# EAGLE design apu-csk-motherboard (EAGLE 9.6.2)

## Sheet 1 of 2
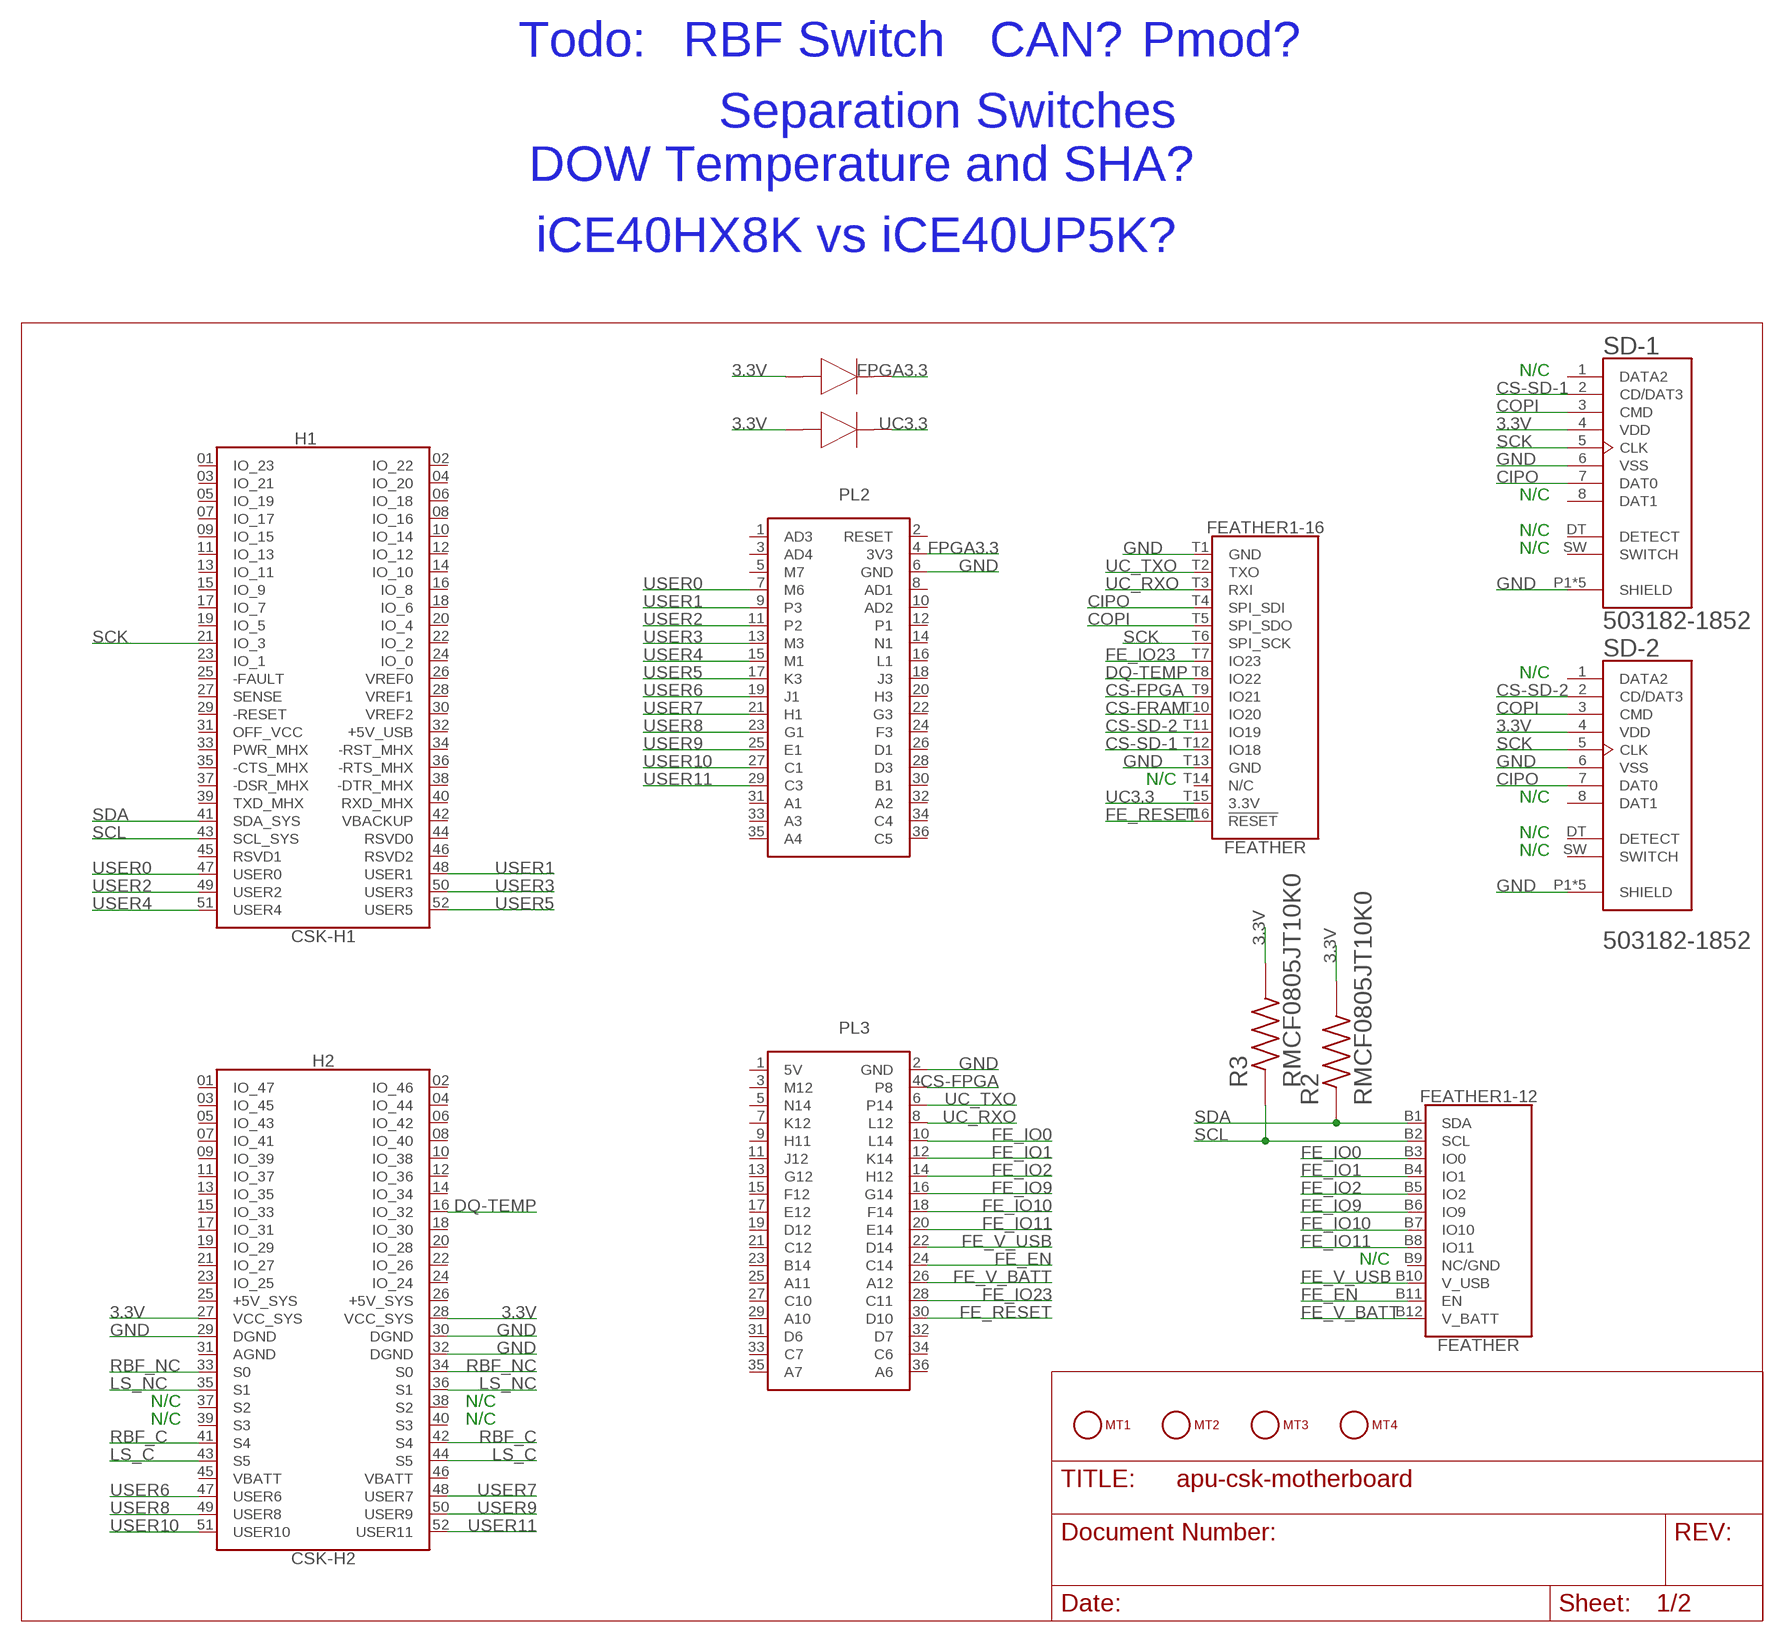
[diagram p0: schematic, sheet 1]

### Parts
B1  DIO_PMEG4030ER,115  [DIO_PMEG4030ER,115]
B2  DIO_PMEG4030ER,115  [DIO_PMEG4030ER,115]
FEATHER1  FEATHER  [FEATHER]
H1  CSK-H1  [SAMTEC_ESQ-126-37-G-D--NUMBERED-FOR-CUBESAT-BUS]
H2  CSK-H2  [SAMTEC_ESQ-126-37-G-D--NUMBERED-FOR-CUBESAT-BUS]
MT1  MOUNTING_HOLE-125_250_ROUND  [MT_125_250]
MT2  MOUNTING_HOLE-125_250_ROUND  [MT_125_250]
MT3  MOUNTING_HOLE-125_250_ROUND  [MT_125_250]
MT4  MOUNTING_HOLE-125_250_ROUND  [MT_125_250]
PL2  ICEWERX-PL2  [TE_4-1734506-1]
PL3  ICEWERX-PL3  [TE_4-1734506-1]
R2  RMCF0805JT10K0  [RESC2012X65N]
R3  RMCF0805JT10K0  [RESC2012X65N]
SD-1  503182-1852  [MOLEX_503182-1852]
SD-2  503182-1852  [MOLEX_503182-1852]

### Nets
3.3V: B1.2(ANODE) B2.2(ANODE) H2.27(VCC_SYS) H2.28(VCC_SYS) R2.2 R3.2 SD-1.4(VDD) SD-2.4(VDD) ; also sheet 2
CIPO: FEATHER1.T4(-16:SPI_SDI) SD-1.7(DAT0) SD-2.7(DAT0) ; also sheet 2
COPI: FEATHER1.T5(-16:SPI_SDO) SD-1.3(CMD) SD-2.3(CMD) ; also sheet 2
CS-FPGA: FEATHER1.T9(-16:IO21) PL3.4(P8)
CS-FRAM: FEATHER1.T10(-16:IO20) ; also sheet 2
CS-SD-1: FEATHER1.T12(-16:IO18) SD-1.2(CD/DAT3)
CS-SD-2: FEATHER1.T11(-16:IO19) SD-2.2(CD/DAT3)
DQ-TEMP: FEATHER1.T8(-16:IO22) H2.16(IO_32) ; also sheet 2
FE_EN: FEATHER1.B11(-12:EN) PL3.24(C14)
FE_IO0: FEATHER1.B3(-12:IO0) PL3.10(L14)
FE_IO1: FEATHER1.B4(-12:IO1) PL3.12(K14)
FE_IO2: FEATHER1.B5(-12:IO2) PL3.14(H12)
FE_IO9: FEATHER1.B6(-12:IO9) PL3.16(G14)
FE_IO10: FEATHER1.B7(-12:IO10) PL3.18(F14)
FE_IO11: FEATHER1.B8(-12:IO11) PL3.20(E14)
FE_IO23: FEATHER1.T7(-16:IO23) PL3.28(C11)
FE_RESET: FEATHER1.T16(-16:!RESET) PL3.30(D10)
FE_V_BATT: FEATHER1.B12(-12:V_BATT) PL3.26(A12)
FE_V_USB: FEATHER1.B10(-12:V_USB) PL3.22(D14)
FPGA3.3: B1.1(CATHODE) PL2.4(3V3)
GND: FEATHER1.T1(-16:GND) FEATHER1.T13(-16:GND) H2.29(DGND) H2.30(DGND) H2.32(DGND) PL2.6(GND) PL3.2(GND) SD-1.6(VSS) SD-1.P1(SHIELD) SD-1.P2(SHIELD) SD-1.P3(SHIELD) SD-1.P4(SHIELD) SD-1.P5(SHIELD) SD-2.6(VSS) SD-2.P1(SHIELD) SD-2.P2(SHIELD) SD-2.P3(SHIELD) SD-2.P4(SHIELD) SD-2.P5(SHIELD) ; also sheet 2
LS_C: H2.43(S5) H2.44(S5) ; also sheet 2
LS_NC: H2.35(S1) H2.36(S1) ; also sheet 2
RBF_C: H2.41(S4) H2.42(S4) ; also sheet 2
RBF_NC: H2.33(S0) H2.34(S0) ; also sheet 2
SCK: FEATHER1.T6(-16:SPI_SCK) H1.21(IO_3) SD-1.5(CLK) SD-2.5(CLK) ; also sheet 2
SCL: FEATHER1.B2(-12:SCL) H1.43(SCL_SYS) R3.1 ; also sheet 2
SDA: FEATHER1.B1(-12:SDA) H1.41(SDA_SYS) R2.1 ; also sheet 2
UC3.3: B2.1(CATHODE) FEATHER1.T15(-16:3.3V)
UC_RXO: FEATHER1.T3(-16:RXI) PL3.8(L12)
UC_TXO: FEATHER1.T2(-16:TXO) PL3.6(P14)
USER0: H1.47(USER0) PL2.7(M6)
USER1: H1.48(USER1) PL2.9(P3)
USER2: H1.49(USER2) PL2.11(P2)
USER3: H1.50(USER3) PL2.13(M3)
USER4: H1.51(USER4) PL2.15(M1)
USER5: H1.52(USER5) PL2.17(K3)
USER6: H2.47(USER6) PL2.19(J1)
USER7: H2.48(USER7) PL2.21(H1)
USER8: H2.49(USER8) PL2.23(G1)
USER9: H2.50(USER9) PL2.25(E1)
USER10: H2.51(USER10) PL2.27(C1)
USER11: H2.52(USER11) PL2.29(C3)
Unconnected: FEATHER1.B9(-12:NC/GND) FEATHER1.T14(-16:N/C) H1.01(IO_23) H1.02(IO_22) H1.03(IO_21) H1.04(IO_20) H1.05(IO_19) H1.06(IO_18) H1.07(IO_17) H1.08(IO_16) H1.09(IO_15) H1.10(IO_14) H1.11(IO_13) H1.12(IO_12) H1.13(IO_11) H1.14(IO_10) H1.15(IO_9) H1.16(IO_8) H1.17(IO_7) H1.18(IO_6) H1.19(IO_5) H1.20(IO_4) H1.22(IO_2) H1.23(IO_1) H1.24(IO_0) H1.25(-FAULT) H1.26(VREF0) H1.27(SENSE) H1.28(VREF1) H1.29(-RESET) H1.30(VREF2) H1.31(OFF_VCC) H1.32(+5V_USB) H1.33(PWR_MHX) H1.34(-RST_MHX) H1.35(-CTS_MHX) H1.36(-RTS_MHX) H1.37(-DSR_MHX) H1.38(-DTR_MHX) H1.39(TXD_MHX) H1.40(RXD_MHX) H1.42(VBACKUP) H1.44(RSVD0) H1.45(RSVD1) H1.46(RSVD2) H2.01(IO_47) H2.02(IO_46) H2.03(IO_45) H2.04(IO_44) H2.05(IO_43) H2.06(IO_42) H2.07(IO_41) H2.08(IO_40) H2.09(IO_39) H2.10(IO_38) H2.11(IO_37) H2.12(IO_36) H2.13(IO_35) H2.14(IO_34) H2.15(IO_33) H2.17(IO_31) H2.18(IO_30) H2.19(IO_29) H2.20(IO_28) H2.21(IO_27) H2.22(IO_26) H2.23(IO_25) H2.24(IO_24) H2.25(+5V_SYS) H2.26(+5V_SYS) H2.31(AGND) H2.37(S2) H2.38(S2) H2.39(S3) H2.40(S3) H2.45(VBATT) H2.46(VBATT) MT1.1 MT2.1 MT3.1 MT4.1 PL2.1(AD3) PL2.2(RESET) PL2.3(AD4) PL2.5(M7) PL2.8(AD1) PL2.10(AD2) PL2.12(P1) PL2.14(N1) PL2.16(L1) PL2.18(J3) PL2.20(H3) PL2.22(G3) PL2.24(F3) PL2.26(D1) PL2.28(D3) PL2.30(B1) PL2.31(A1) PL2.32(A2) PL2.33(A3) PL2.34(C4) PL2.35(A4) PL2.36(C5) PL3.1(5V) PL3.3(M12) PL3.5(N14) PL3.7(K12) PL3.9(H11) PL3.11(J12) PL3.13(G12) PL3.15(F12) PL3.17(E12) PL3.19(D12) PL3.21(C12) PL3.23(B14) PL3.25(A11) PL3.27(C10) PL3.29(A10) PL3.31(D6) PL3.32(D7) PL3.33(C7) PL3.34(C6) PL3.35(A7) PL3.36(A6) SD-1.1(DATA2) SD-1.8(DAT1) SD-1.DT(DETECT) SD-1.SW(SWITCH) SD-2.1(DATA2) SD-2.8(DAT1) SD-2.DT(DETECT) SD-2.SW(SWITCH)

### Notes on the sheet
- Todo: | RBF Switch | CAN? | Pmod?
- Separation Switches
- DOW Temperature and SHA?
- iCE40HX8K vs iCE40UP5K?
- N/C
- N/C
- N/C
- N/C
- N/C
- N/C
- N/C
- N/C
- N/C
- N/C
- N/C | N/C
- N/C | N/C

## Sheet 2 of 2
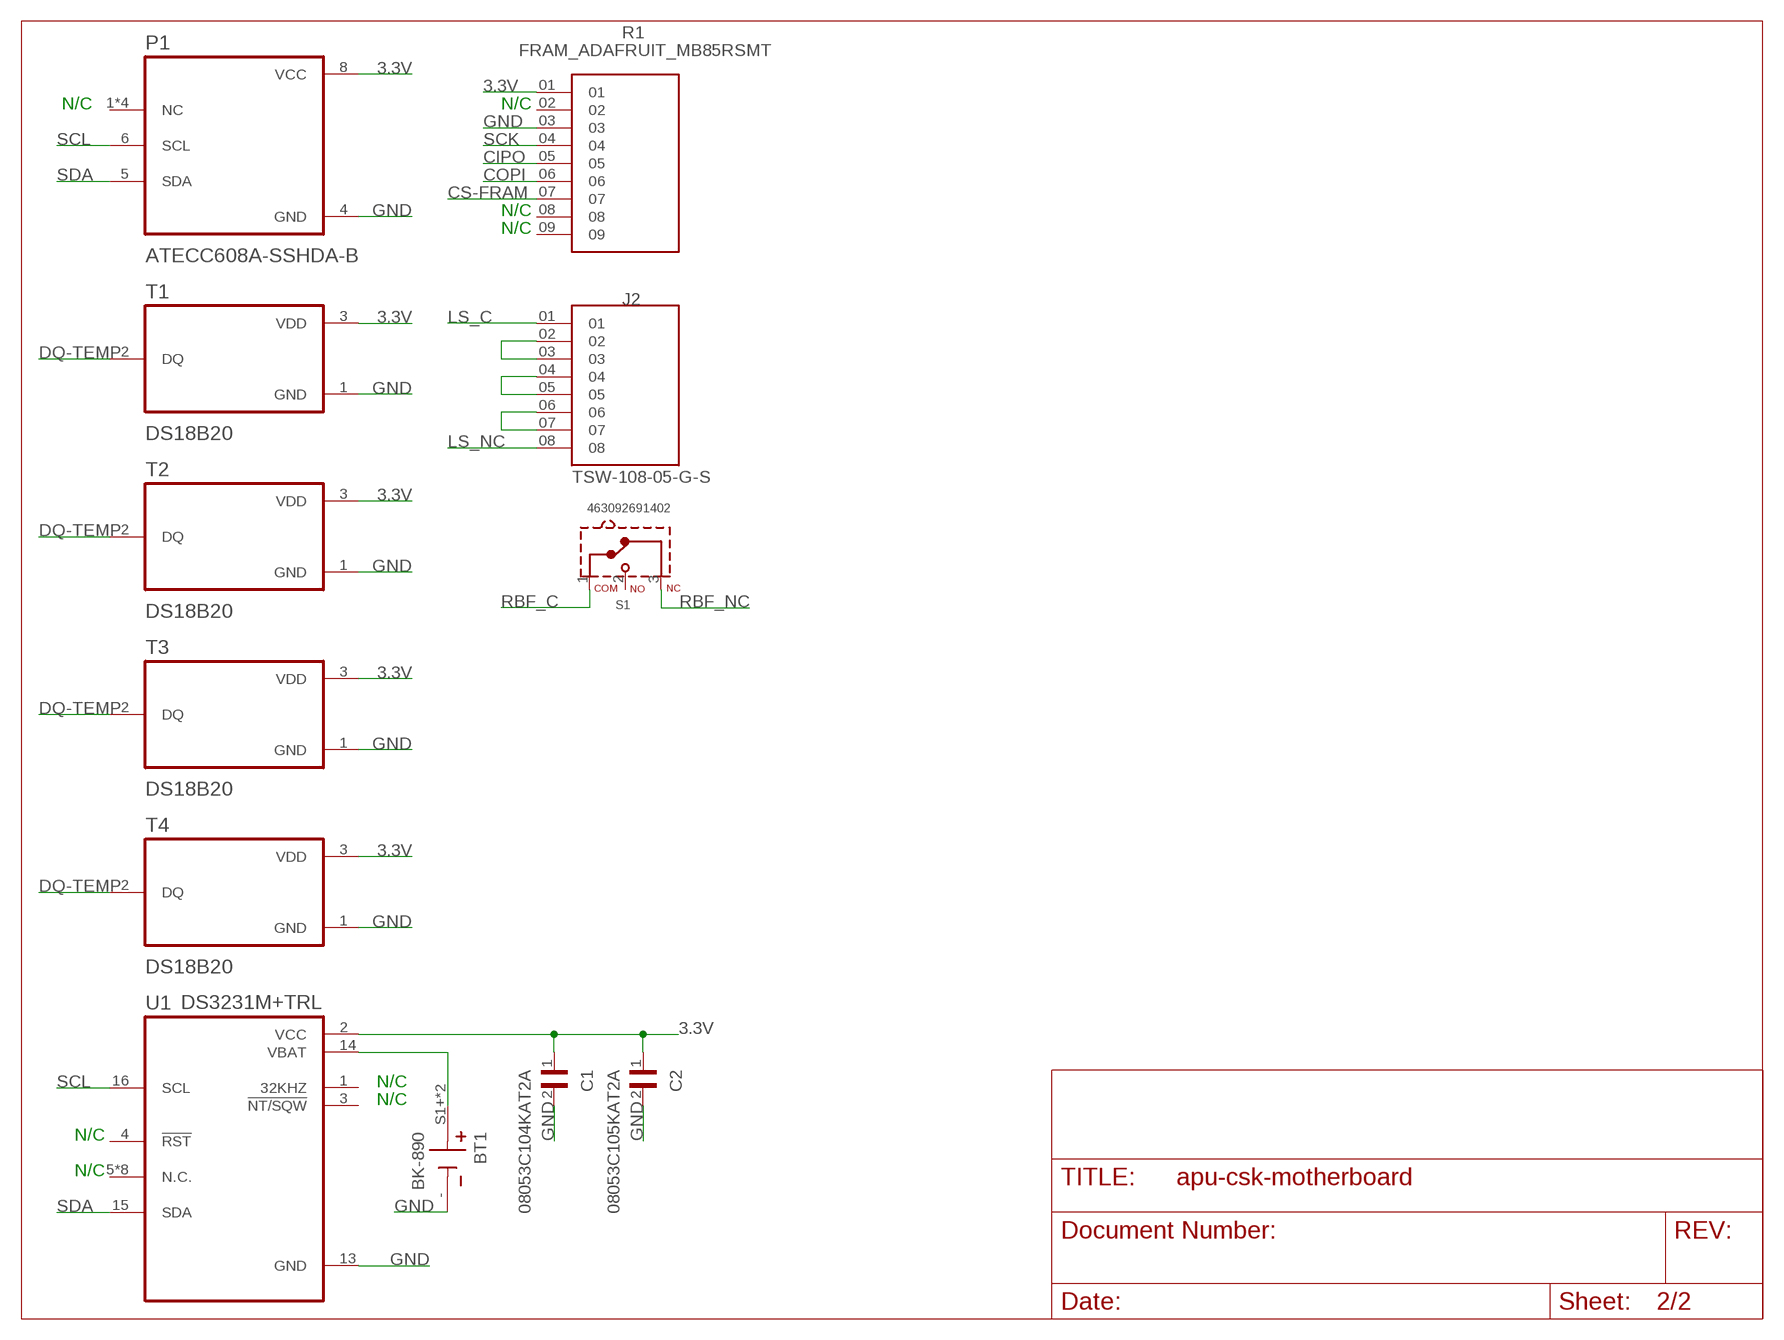
[diagram p1: schematic, sheet 2]

### Parts
BT1  BK-890  [BAT_BK-890]
C1  08053C104KAT2A  [CAPC2012X94N]
C2  08053C105KAT2A  [CAPC2012X94N]
J2  TSW-108-05-G-S  [SAMTEC_TSW-108-05-G-S]
P1  ATECC608A-SSHDA-B  [SOIC127P600X175-8N]
R1  FRAM_ADAFRUIT_MB85RSMT  [FRAM_ADAFRUIT_MB85RSMT]
S1  463092691402  [463092691402]
T1  DS18B20  [TO92269P495H695-3]
T2  DS18B20  [TO92269P495H695-3]
T3  DS18B20  [TO92269P495H695-3]
T4  DS18B20  [TO92269P495H695-3]
U1  DS3231M+TRL  [SOIC127P1032X265-16N]

### Nets
3.3V: C1.1 C2.1 P1.8(VCC) R1.01 T1.3(VDD) T2.3(VDD) T3.3(VDD) T4.3(VDD) U1.2(VCC) ; also sheet 1
CIPO: R1.05 ; also sheet 1
COPI: R1.06 ; also sheet 1
CS-FRAM: R1.07 ; also sheet 1
DQ-TEMP: T1.2(DQ) T2.2(DQ) T3.2(DQ) T4.2(DQ) ; also sheet 1
GND: BT1.- C1.2 C2.2 P1.4(GND) R1.03 T1.1(GND) T2.1(GND) T3.1(GND) T4.1(GND) U1.13(GND) ; also sheet 1
LS_C: J2.01 ; also sheet 1
LS_NC: J2.08 ; also sheet 1
N$1: BT1.S1+(+) BT1.S2+(+) U1.14(VBAT)
N$3: J2.02 J2.03
N$4: J2.04 J2.05
N$5: J2.06 J2.07
RBF_C: S1.1(COM) ; also sheet 1
RBF_NC: S1.3(NC) ; also sheet 1
SCK: R1.04 ; also sheet 1
SCL: P1.6(SCL) U1.16(SCL) ; also sheet 1
SDA: P1.5(SDA) U1.15(SDA) ; also sheet 1
Unconnected: P1.1(NC) P1.2(NC) P1.3(NC) P1.7(NC) R1.02 R1.08 R1.09 S1.2(NO) U1.1(32KHZ) U1.3(!NT/SQW) U1.4(!RST) U1.5(N.C.) U1.6(N.C.) U1.7(N.C.) U1.8(N.C.) U1.9(N.C.) U1.10(N.C.) U1.11(N.C.) U1.12(N.C.)

### Notes on the sheet
- N/C | N/C
- N/C
- N/C
- N/C
- N/C
- N/C
- N/C

## Library data of the parts
B1 B2 = apu-csk-motherboard:DIO_PMEG4030ER,115
BT1 = apu-csk-motherboard:BK-890: BATTERY RETAINER COIN PC PIN Check availability; AVAILABILITY: In Stock; DESCRIPTION: BATTERY RETAINER COIN PC PIN; MF: MPD; MP: BK-890; PACKAGE: DFN-12 MPD; PRICE: None; PURCHASE-URL: https://pricing.snapeda.com/search/part/BK-890/?ref=eda
C1 = apu-csk-motherboard:08053C104KAT2A: Cap Ceramic 0.1uF 25V X7R 10% Pad SMD 0805 125 T/R Check availability; AVAILABILITY: In Stock; DESCRIPTION: 0.1 µF ±10% 25V Ceramic Capacitor X7R 0805 (2012 Metric); MF: AVX; MP: 08053C104KAT2A; PACKAGE: 2012 AVX; PRICE: None; PURCHASE-URL: https://pricing.snapeda.com/search/part/08053C104KAT2A/?ref=eda
C2 = apu-csk-motherboard:08053C105KAT2A: Cap Ceramic 1uF 25V X7R 10% SMD 0805 125°C Embossed T/R Check availability; AVAILABILITY: In Stock; DESCRIPTION: 1 µF ±10% 25V Ceramic Capacitor X7R 0805 (2012 Metric); MF: AVX; MP: 08053C105KAT2A; PACKAGE: 2012 AVX; PRICE: None; PURCHASE-URL: https://pricing.snapeda.com/search/part/08053C105KAT2A/?ref=eda
FEATHER1 = apu-csk-motherboard:FEATHER
H1 = apu-csk-motherboard:CSK-H1
H2 = apu-csk-motherboard:CSK-H2
J2 = apu-csk-motherboard:TSW-108-05-G-S: Check availability; AVAILABILITY: In Stock; DESCRIPTION: TSW - Samtec 2.54mm Pin Header 8.51mm Overall Pin Length (05) - Fast Stock; MF: Samtec; MP: TSW-108-05-G-S; PACKAGE: None; PRICE: None; PURCHASE-URL: https://pricing.snapeda.com/search/part/TSW-108-05-G-S/?ref=eda
MT1-MT4 = apu-csk-motherboard:MOUNTING_HOLE
P1 = apu-csk-motherboard:ATECC608A-SSHDA-B: None Check availability; AVAILABILITY: In Stock; DESCRIPTION: IC AUTHENTICATION CHIP 8SOIC; MF: Microchip Technology; MP: ATECC608A-SSHDA-B; PACKAGE: SOIC-8 Microchip Technology; PRICE: None; PURCHASE-URL: https://pricing.snapeda.com/search/part/ATECC608A-SSHDA-B/?ref=eda
PL2 = apu-csk-motherboard:ICEWERX-PL2
PL3 = apu-csk-motherboard:ICEWERX-PL3
R1 = apu-csk-motherboard:FRAM_ADAFRUIT_MB85RSMT
R2 R3 = apu-csk-motherboard:RMCF0805JT10K0: Check availability; AVAILABILITY: In Stock; DESCRIPTION: 10 kOhms ±5% 0.125W, 1/8W Chip Resistor 0805 (2012 Metric) Automotive AEC-Q200 Thick Film; MF: Stackpole Electronics Inc; MP: RMCF0805JT10K0; PACKAGE: 2012 Stackpole; PRICE: None; PURCHASE-URL: https://pricing.snapeda.com/search/part/RMCF0805JT10K0/?ref=eda
S1 = apu-csk-motherboard:463092691402: WS-MITV THT Terminal with Lever, Right Angle Operation Micro Switch, 12.8 x 5.8 mm Material Properties Actuator Material PBT Actuator Flammability Rating UL94 V-0 Actuator Color White Frame Material PBT Frame Flammability Rating UL94 V-0 Moveable Contact Material Silver Stationary Contact Material Silver Terminal Material Copper Alloy Terminal Plating Silver Mechanical Properties Operating Position 6.8 mm Over travel 0.55 mm Movement Differential 0.5 mm Electrical Life 10000 Cycles General Information Operating Temperature -40 up to +85 °C Packaging Properties Packaging Tray Details see: https://www.we-online.com/catalog/en/MITV_THT_TERMINAL_LEVER_RIGHT_ANGLE_MICRO_SWITCH_12_8X5_8 Created by Ella Wu, 2021-03-12 2021 (C) Wurth Elektronik Check availability; AVAILABILITY: In Stock; DESCRIPTION: Basic / Snap Action Switches WS-MITV Micro Switch RA Psh Typ 80gf; MF: Würth Elektronik; MP: 463092691402; PACKAGE: None; PRICE: None; PURCHASE-URL: https://pricing.snapeda.com/search/part/463092691402/?ref=eda
SD-1 SD-2 = apu-csk-motherboard:503182-1852: Conn Micro SD Card M 8 POS 1.09mm Solder RA SMD Embossed T/R 0.5A/Contact Check availability; AVAILABILITY: In Stock; DESCRIPTION: 10 (8 + 2) Position Card Connector Secure Digital - microSD™ Surface Mount, Right Angle Gold; MF: Molex; MP: 5031821852; PACKAGE: None; PRICE: None; PURCHASE-URL: https://pricing.snapeda.com/search/part/5031821852/?ref=eda
T1-T4 = apu-csk-motherboard:DS18B20: Check availability; AVAILABILITY: In Stock; DESCRIPTION: Programmable Resolution 1-Wire Digital Thermometer; MF: Analog Devices; MP: DS18B20+T&amp;R; PACKAGE: TO92-3 Maxim; PRICE: None; PURCHASE-URL: https://pricing.snapeda.com/search/part/DS18B20+T&amp;R/?ref=eda
U1 = apu-csk-motherboard:DS3231M+TRL: Check availability; AVAILABILITY: In Stock; DESCRIPTION: ±5ppm, I2C Real-Time Clock; MF: Analog Devices; MP: DS3231M+TRL; PACKAGE: SOIC-16 Maxim; PRICE: None; PURCHASE-URL: https://pricing.snapeda.com/search/part/DS3231M+TRL/?ref=eda

## Board
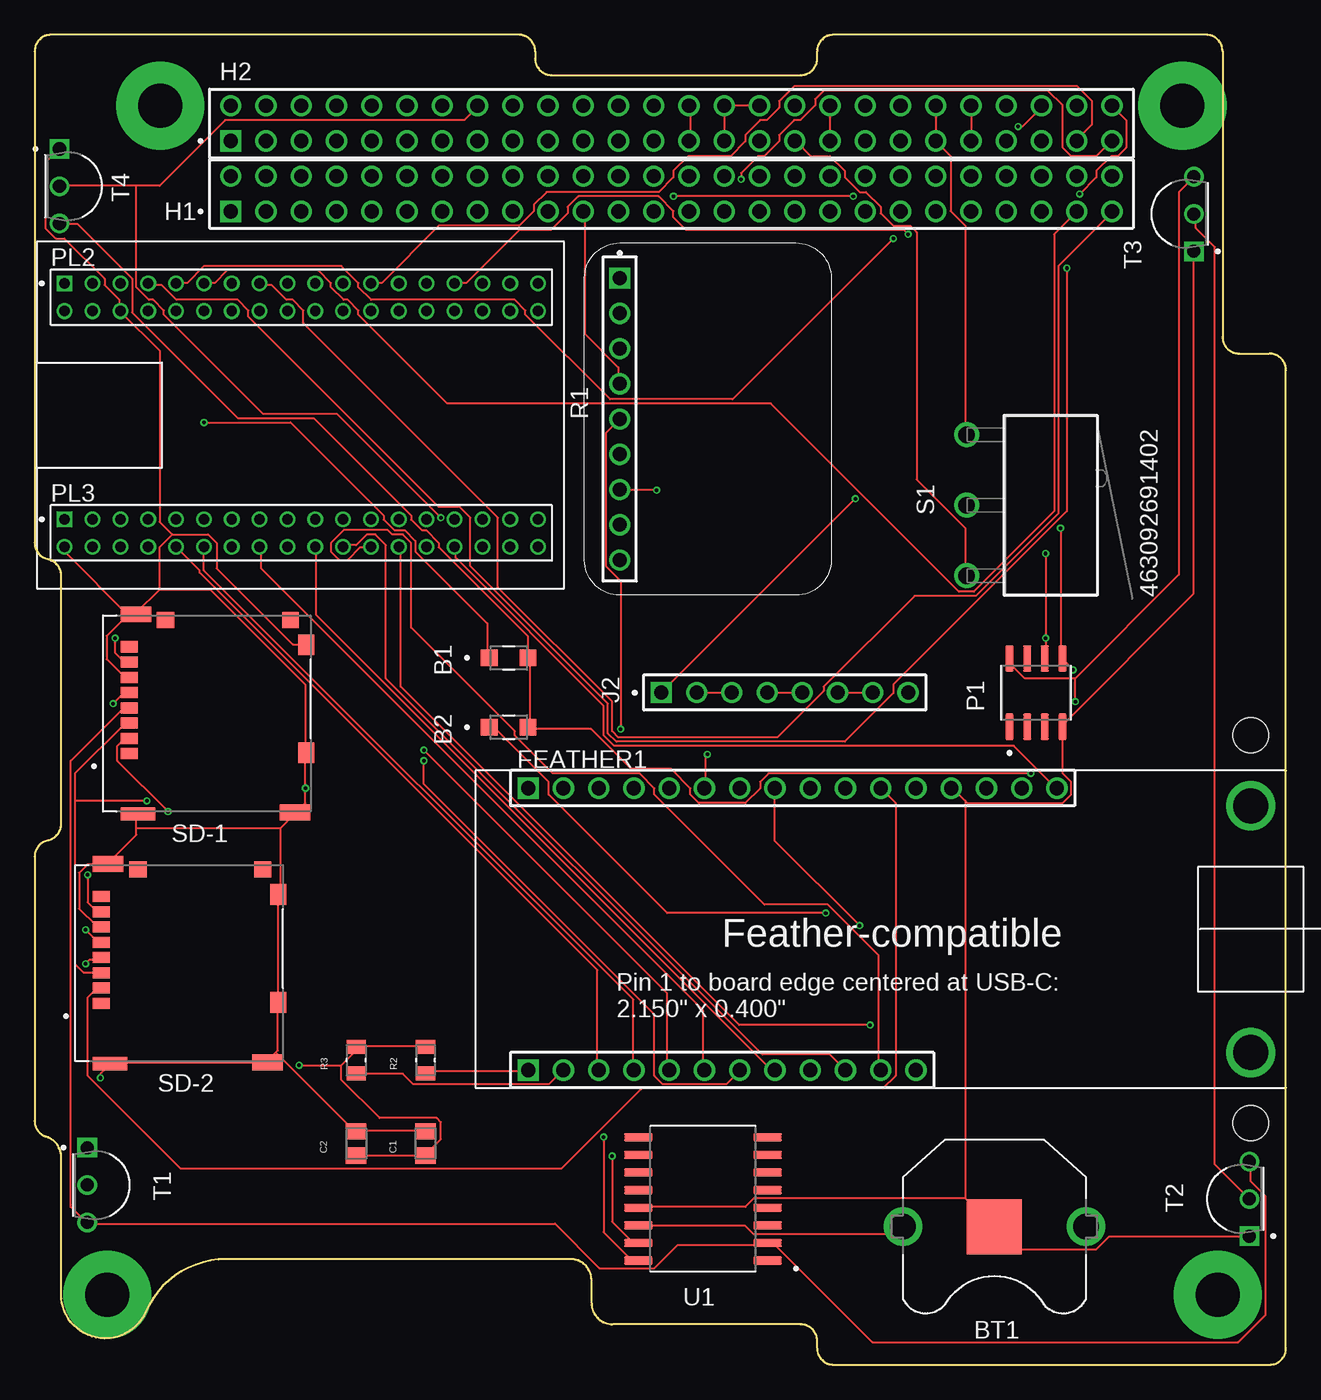
[diagram p2: board, top side]
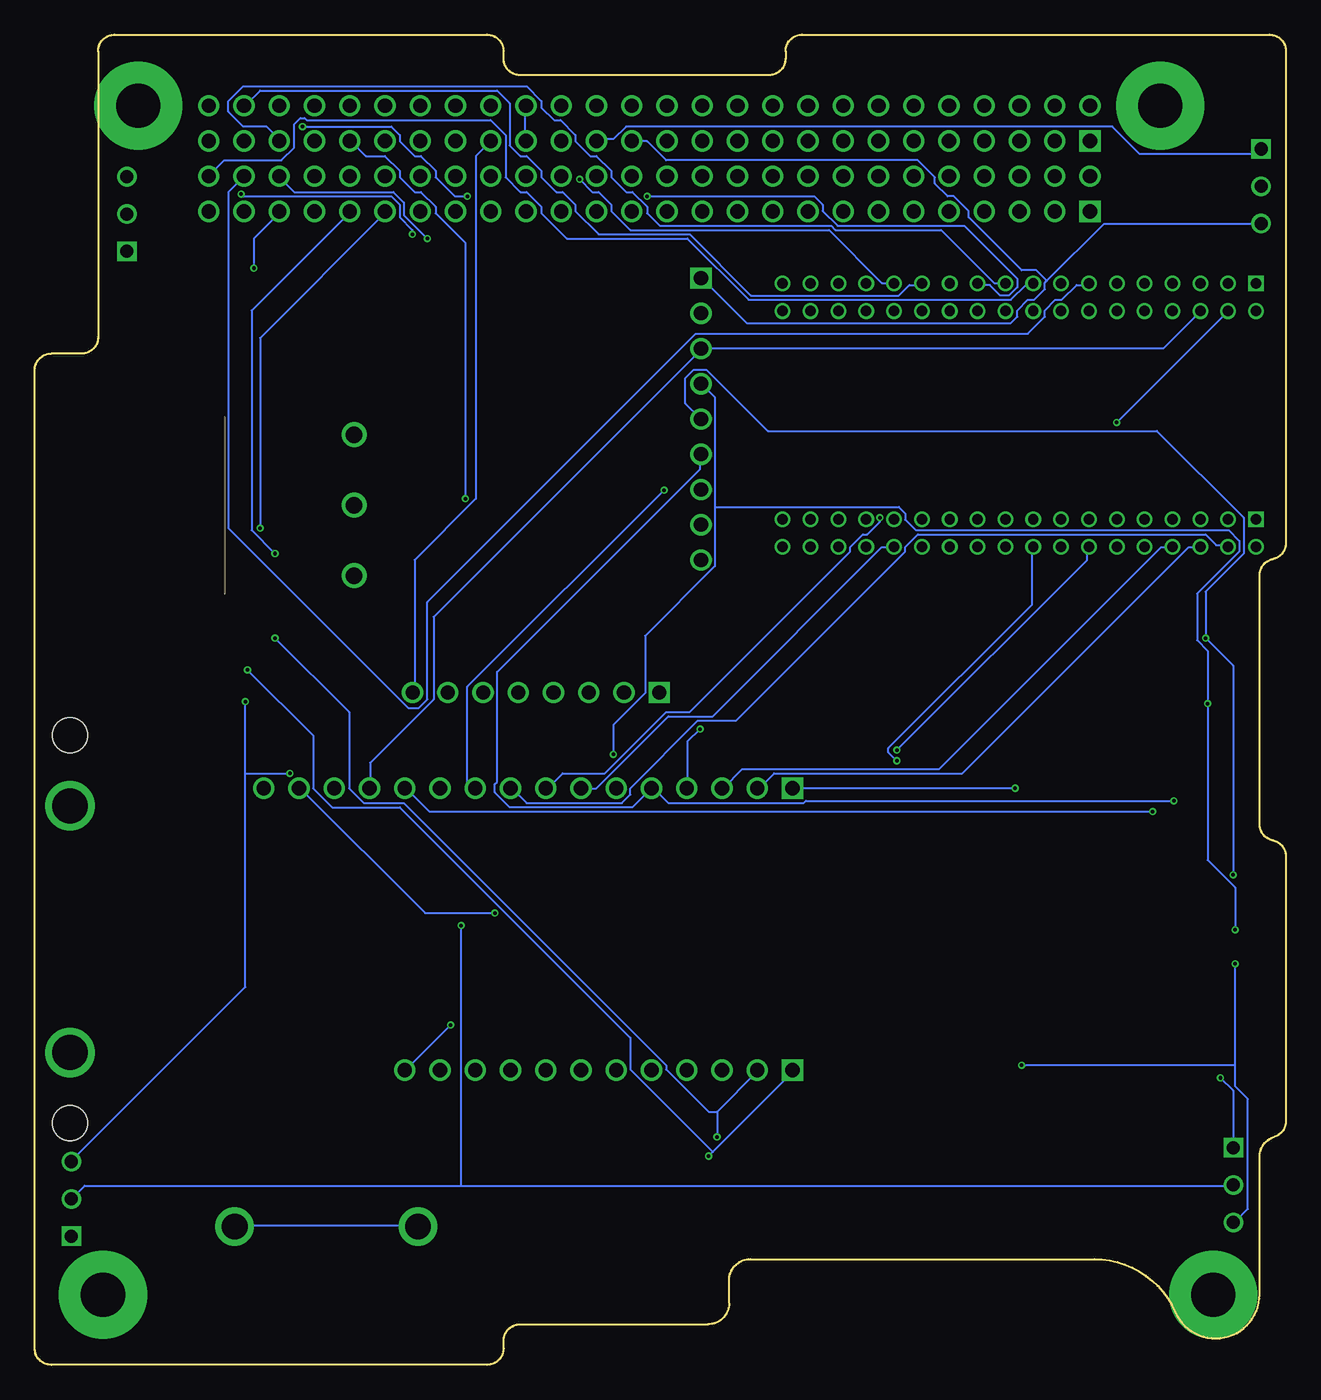
[diagram p3: board, bottom side, seen from below]

Size 90.17 x 95.89 mm. Coordinates in mm from the lower left corner, seen from the top.
Outline: 40.13,4.45 arc90 41.65,2.92 55.19,2.92 arc-90 56.39,1.73 56.39,1.19 arc90 57.58,0 88.98,0 arc90 90.17,1.19 90.17,71.7 arc90 88.98,72.9 86.79,72.9 arc-90 85.6,74.09 85.6,94.69 arc90 84.4,95.88 57.58,95.88 arc90 56.39,94.69 56.39,94.16 arc-90 55.19,92.96 37.26,92.96 arc-90 36.07,94.16 36.07,94.69 arc90 34.87,95.88 1.19,95.88 arc90 0,94.69 0,59.25 arc78 0.95,58.08 arc-78 1.91,56.91 1.91,38.98 arc-78 0.95,37.81 arc78 0,36.64 0,17.58 arc73 0.84,16.44 arc-73 1.91,14.99 1.91,5.08 arc156 7.99,3.81 arc-66 13.81,7.62 38.61,7.62 arc-90 40.13,6.1 40.13,4.45
Copper layers (1*16): Top 0.035559375mm / dielectric 1.6mm / Bottom 0.035559375mm
Design rules "oshpark-2layer": minimum track width 6mil, minimum drill 10mil, track to track 6mil, track to pad 6mil, pad to pad 6mil, via to via 6mil, smd to smd 6mil, copper to edge 15mil, drill to drill 6mil, minimum pad ring 5mil, minimum via ring 5mil, stop-mask expansion 2.5mil, vias tented up to drill 0mil, thermal gap 10mil

### Footprints (pad centres in the part's own frame; a part is rotated, then mirrored left to right if it is on the bottom)
DIO_PMEG4030ER,115 = smd 1.2 x 1.2: 1 -1.4,0; 2 1.4,0
BAT_BK-890 = smd 3.96 x 3.96: - 0,0 | drill 1.85: S1+ -6.6,0; S2+ 6.6,0
CAPC2012X94N = smd 1.16 x 1.47: 1 -0.88,0; 2 0.88,0
FEATHER = drill 1.02 pad 1.37 square: B1 0,0; T1 0,20.32 | drill 1.02 pad 1.37: B2 2.54,0; B3 5.08,0; B4 7.62,0; B5 10.16,0; B6 12.7,0; B7 15.24,0; B8 17.78,0; B9 20.32,0; B10 22.86,0; B11 25.4,0; B12 27.94,0; T2 2.54,20.32; T3 5.08,20.32; T4 7.62,20.32; T5 10.16,20.32; T6 12.7,20.32; T7 15.24,20.32; T8 17.78,20.32; T9 20.32,20.32; T10 22.86,20.32; T11 25.4,20.32; T12 27.94,20.32; T13 30.48,20.32; T14 33.02,20.32; T15 35.56,20.32; T16 38.1,20.32 | drill 2.54: MT1 52.07,19.05; MT2 52.07,1.27 | hole 2.54: 52.07,24.13; 52.07,-3.81
SAMTEC_ESQ-126-37-G-D--NUMBERED-FOR-CUBESAT-BUS = drill 1.02 pad 1.37 square: 01 0,0 | drill 1.02 pad 1.37: 02 0,2.54; 03 2.54,0; 04 2.54,2.54; 05 5.08,0; 06 5.08,2.54; 07 7.62,0; 08 7.62,2.54; 09 10.16,0; 10 10.16,2.54; 11 12.7,0; 12 12.7,2.54; 13 15.24,0; 14 15.24,2.54; 15 17.78,0; 16 17.78,2.54; 17 20.32,0; 18 20.32,2.54; 19 22.86,0; 20 22.86,2.54; 21 25.4,0; 22 25.4,2.54; 23 27.94,0; 24 27.94,2.54; 25 30.48,0; 26 30.48,2.54; 27 33.02,0; 28 33.02,2.54; 29 35.56,0; 30 35.56,2.54; 31 38.1,0; 32 38.1,2.54; 33 40.64,0; 34 40.64,2.54; 35 43.18,0; 36 43.18,2.54; 37 45.72,0; 38 45.72,2.54; 39 48.26,0; 40 48.26,2.54; 41 50.8,0; 42 50.8,2.54; 43 53.34,0; 44 53.34,2.54; 45 55.88,0; 46 55.88,2.54; 47 58.42,0; 48 58.42,2.54; 49 60.96,0; 50 60.96,2.54; 51 63.5,0; 52 63.5,2.54
SAMTEC_TSW-108-05-G-S = drill 1.02 pad 1.37 square: 01 0,0 | drill 1.02 pad 1.37: 02 2.54,0; 03 5.08,0; 04 7.62,0; 05 10.16,0; 06 12.7,0; 07 15.24,0; 08 17.78,0
MT_125_250 = drill 3.175 pad 6.35: 1 0,0
SOIC127P600X175-8N = smd 1.9 x 0.6: 1 -2.455,1.905; 2 -2.455,0.635; 3 -2.455,-0.635; 4 -2.455,-1.905; 5 2.455,-1.905; 6 2.455,-0.635; 7 2.455,0.635; 8 2.455,1.905
TE_4-1734506-1 = drill 0.75 pad 1.1 square: 1 0,0 | drill 0.75 pad 1.1: 2 0,-2; 3 2.007,0; 4 2.007,-2; 5 4.013,0; 6 4.013,-2; 7 6.02,0; 8 6.02,-2; 9 8.026,0; 10 8.026,-2; 11 10.033,0; 12 10.033,-2; 13 12.04,0; 14 12.04,-2; 15 14.046,0; 16 14.046,-2; 17 16.053,0; 18 16.053,-2; 19 18.059,0; 20 18.059,-2; 21 20.066,0; 22 20.066,-2; 23 22.073,0; 24 22.073,-2; 25 24.079,0; 26 24.079,-2; 27 26.086,0; 28 26.086,-2; 29 28.092,0; 30 28.092,-2; 31 30.099,0; 32 30.099,-2; 33 32.106,0; 34 32.106,-2; 35 34.112,0; 36 34.112,-2
FRAM_ADAFRUIT_MB85RSMT = drill 1.02 pad 1.37 square: 01 -0.381,0 | drill 1.02 pad 1.37: 02 2.159,0; 03 4.699,0; 04 7.239,0; 05 9.779,0; 06 12.319,0; 07 14.859,0; 08 17.399,0; 09 19.939,0
RESC2012X65N = smd 1.01 x 1.38: 1 -0.95,0; 2 0.95,0
463092691402 = drill 1.2: 1 -5.08,0; 2 0,0; 3 5.08,0
MOLEX_503182-1852 = smd 0.8 x 1.24: 1 -2.9,6.355; 2 -1.8,6.355; 3 -0.7,6.355; 4 0.4,6.355; 5 1.5,6.355; 6 2.6,6.355; 7 3.7,6.355; 8 4.8,6.355 | smd 1.16 x 1.2: DT 6.74,-5.275 | smd 0.95 x 2.5: P1 -7.245,5.725 | smd 1.15 x 2.2: P2 7.145,5.875; P3 -7.145,-5.605 | smd 1.5 x 1.15: P4 -2.84,-6.4; P5 4.94,-6.4 | smd 1.16 x 1.25: SW 6.74,3.725
TO92269P495H695-3 = drill 0.94 pad 1.41 square: 1 -2.69,-1.37 | drill 0.94 pad 1.41: 2 0,-1.37; 3 2.69,-1.37
SOIC127P1032X265-16N = smd 2.05 x 0.59: 1 -4.655,4.445; 2 -4.655,3.175; 3 -4.655,1.905; 4 -4.655,0.635; 5 -4.655,-0.635; 6 -4.655,-1.905; 7 -4.655,-3.175; 8 -4.655,-4.445; 9 4.655,-4.445; 10 4.655,-3.175; 11 4.655,-1.905; 12 4.655,-0.635; 13 4.655,0.635; 14 4.655,1.905; 15 4.655,3.175; 16 4.655,4.445

### Placement (x,y rotation side)
B1  34.16,50.96 0 top
B2  34.16,45.96 0 top
BT1  69.16,9.96 180 top
C1  28.16,15.96 90 top
C2  23.16,15.96 90 top
FEATHER1  35.56,21.24 0 top
H1  14.13,83.14 0 top
H2  14.13,88.22 0 top
J2  45.16,48.46 0 top
MT1  5.24,5.04 0 top
MT2  85.25,5.04 0 top
MT3  9.05,90.76 0 top
MT4  82.71,90.76 0 top
P1  72.16,48.46 90 top
PL2  2.16,77.96 0 top
PL3  2.16,60.96 0 top
R1  42.16,77.96 270 top
R2  28.16,21.96 90 top
R3  23.16,21.96 90 top
S1  67.16,61.96 270 top
SD-1  13.16,46.96 90 top
SD-2  11.16,28.96 90 top
T1  5.16,12.96 270 top
T2  86.16,11.96 90 top
T3  82.16,82.96 90 top
T4  3.16,84.96 270 top
U1  48.16,11.96 180 top

### Tracks (layer width: path | path; a pad name or v marks a point on that pad's centre or on a via)
3.3V  (via drill 0.25)
  Top 0.152: H2.27 47.25,88.35 47.25,90.64 H2.28 | T4.3 1.84,82.26 3.06,82.26 7.02,78.29 7.02,75.85 14.64,68.23 20.12,68.23 27.13,61.22 27.13,60.92 27.9,60.16 28.2,60.16 29.12,59.24 29.12,58.94 35.52,52.54 35.52,51.01 B1.2 35.67,50.86 35.67,45.98 B2.2 35.67,45.83 40.09,45.83 42.98,42.94 45.88,42.94 47.25,41.56 47.25,41.11 47.86,40.5 51.21,40.5 52.28,41.56 52.28,42.02 52.89,42.63 v71.79,42.63 | 74.99,49.49 71.33,49.49 70.26,50.56 70.26,50.86 P1.8 | 74.99,49.49 82.46,56.96 82.46,84.54 83.52,85.61 T3.3 | R2.2 28.05,22.97 23.17,22.97 R3.2 23.02,22.82 23.02,22.51 22.11,21.6 | C2.1 23.17,15.05 28.05,15.05 C1.1 28.2,15.2 29.27,16.27 29.27,17.49 28.96,17.79 24.85,17.79 22.11,20.53 22.11,21.6 | v3.66,28.92 3.97,29.22 4.73,29.22 SD-2.4 | SD-1.4 6.71,47.36 6.41,47.36 2.6,43.55 2.6,11.39 3.66,10.32 T1.3 3.82,10.17 37.5,10.17 40.7,6.97 44.66,6.97 46.34,8.65 52.74,8.65 U1.2 52.89,8.65 53.35,8.65 60.36,1.64 86.72,1.64 88.7,3.62 88.7,12.15 87.64,13.22 87.64,14.59 T2.3 | v19.06,21.6 22.11,21.6 | v74.99,47.81 74.99,49.49
  Bottom 0.152: 17.23,78.14 17.38,77.99 17.38,77.53 18.14,76.77 18.6,76.77 19.36,76.01 19.36,75.55 19.82,75.09 38.87,75.09 42.07,78.29 R1.01 | 17.23,78.14 13.11,82.26 1.84,82.26 T4.3 | 17.23,78.14 17.99,78.9 19.06,78.9 22.87,82.71 22.87,83.17 23.93,84.24 24.39,84.24 25.31,85.15 25.31,85.61 26.52,86.83 44.66,86.83 46.03,88.2 47.1,88.2 H2.27 | 3.66,21.6 3.66,20.08 2.75,19.16 2.75,11.24 3.66,10.32 T1.3 | 3.66,21.6 v3.66,28.92 | 3.66,21.6 v19.06,21.6 | 74.99,42.63 74.99,27.24 87.48,14.74 T2.3 | 74.99,42.63 v74.99,47.81 | 74.99,42.63 v71.79,42.63
CIPO  (via drill 0.25)
  Top 0.152: v3.82,35.32 3.82,33.34 4.43,32.73 4.73,32.73 SD-2.7 | v5.8,52.39 5.8,51.32 6.41,50.71 6.71,50.71 SD-1.7 | v42.22,45.83 42.22,56.5 41.16,57.57 41.16,67.17 42.07,68.08 R1.05
  Bottom 0.152: v3.82,35.32 3.82,50.4 v5.8,52.39 5.8,55.74 3.06,58.48 3.06,61.07 9.3,67.32 37.35,67.32 41.76,71.74 42.68,71.74 43.29,71.13 43.29,69.3 42.22,68.23 R1.05 | v42.22,45.83 43.14,44.92 43.14,41.56 FEATHER1.T4
COPI  (via drill 0.25)
  Top 0.152: 2.9,40.65 2.9,42.63 6.41,46.14 6.71,46.14 SD-1.3 | 2.9,40.65 2.9,28.92 3.51,28.31 4.73,28.31 SD-2.3 | v8.08,40.65 2.9,40.65
  Bottom 0.152: R1.06 42.22,65.49 42.22,64.58 56.85,49.95 56.85,42.02 57,41.87 57,41.26 55.94,40.19 47.1,40.19 FEATHER1.T5 45.57,41.56 44.51,40.5 34.75,40.5 34.6,40.65 v8.08,40.65
CS-FPGA
  Bottom 0.152: PL3.4 4.27,59.09 5.04,59.09 5.8,59.85 26.52,59.85 27.44,58.94 27.44,58.63 39.63,46.44 42.37,46.44 47.25,41.56 47.25,41.11 47.86,40.5 54.72,40.5 55.79,41.56 FEATHER1.T9
CS-FRAM  (via drill 0.25)
  Top 0.152: v44.81,63.05 42.22,63.05 R1.07
  Bottom 0.152: v44.81,63.05 58.99,48.88 58.99,42.02 58.53,41.56 FEATHER1.T10
CS-SD-1  (via drill 0.25)
  Top 0.152: v9.61,39.89 5.95,43.55 5.95,44.61 6.41,45.07 6.71,45.07 SD-1.2
  Bottom 0.152: v9.61,39.89 61.73,39.89 63.41,41.56 FEATHER1.T12
CS-SD-2
  Top 0.152: SD-2.2 4.73,27.09 4.43,27.09 3.82,26.48 3.82,20.84 10.52,14.13 37.95,14.13 43.75,19.92 61.12,19.92 62.03,20.84 62.03,40.5 FEATHER1.T11
DQ-TEMP  (via drill 0.25)
  Top 0.152: 7.32,85 9,85 13.72,89.72 30.94,89.72 31.86,90.64 H2.16 | 7.32,85 1.84,85 T4.2 | T3.2 83.67,82.87 83.67,81.95 85.05,80.58 85.05,14.44 87.48,12 T2.2 | v59.44,31.66 53.35,37.75 FEATHER1.T8 | 7.32,85 7.32,77.68 8.24,76.77 8.54,76.77 9.3,76.01 9.3,75.7 16.47,68.54 21.8,68.54 v29.27,61.07
  Bottom 0.152: 59.44,12.91 86.57,12.91 87.48,12 T2.2 | 59.44,12.91 3.82,12.91 T1.2 | 59.44,12.91 v59.44,31.66 | v29.27,61.07 29.27,60.77 30.18,59.85 30.49,59.85 31.4,58.94 31.4,58.63 42.98,47.05 44.66,47.05 49.08,42.63 52.13,42.63 53.19,41.56 FEATHER1.T8
FE_EN
  Top 0.152: PL3.24 24.09,58.94 23.48,58.94 22.56,58.02 21.95,58.02 21.34,58.63 21.34,59.24 22.26,60.16 25.46,60.16 25.76,59.85 26.52,59.85 27.13,59.24 27.13,53.15 34.6,45.68 34.6,45.37 37.35,42.63 43.59,42.63 44.66,41.56 44.66,41.11 52.59,33.18 57.16,33.18 60.81,29.53 60.81,21.3 FEATHER1.B11
FE_IO0
  Top 0.152: PL3.10 10.22,58.94 11.89,57.26 11.89,57.11 40.55,28.46 40.55,21.3 FEATHER1.B3
FE_IO1
  Top 0.152: PL3.12 12.2,58.94 12.2,57.26 43.14,26.32 43.14,21.3 FEATHER1.B4
FE_IO2  (via drill 0.25)
  Top 0.152: v28.05,44.31 45.57,26.78 45.57,21.3 FEATHER1.B5
  Bottom 0.152: v28.05,44.31 14.33,58.02 14.33,58.94 PL3.14
FE_IO9
  Top 0.152: PL3.16 16.31,58.94 16.31,57.41 48.17,25.56 48.17,21.3 FEATHER1.B6
FE_IO10  (via drill 0.25)
  Top 0.152: v28.05,43.55 28.05,41.87 44.66,25.26 44.66,20.84 45.27,20.23 49.84,20.23 50.76,21.14 FEATHER1.B7
  Bottom 0.152: v28.05,43.55 28.66,44.16 28.66,44.46 18.3,54.82 18.3,58.94 PL3.18
FE_IO11
  Top 0.152: PL3.20 20.28,58.94 20.28,54.06 53.19,21.14 FEATHER1.B8
FE_IO23
  Bottom 0.152: FEATHER1.T7 49.69,41.56 44.51,46.75 41.31,46.75 29.12,58.94 28.35,58.94 PL3.28
FE_RESET
  Top 0.152: PL3.30 30.33,58.94 30.33,58.18 41,47.51 41,45.37 41.76,44.61 70.57,44.61 73.62,41.56 FEATHER1.T16
FE_V_BATT  (via drill 0.25)
  Top 0.152: v60.21,24.5 50.76,24.5 26.37,48.88 26.37,58.94 PL3.26
  Bottom 0.152: v60.21,24.5 63.41,21.3 FEATHER1.B12
FE_V_USB
  Top 0.152: PL3.22 22.26,59.09 23.17,59.09 23.93,59.85 24.54,59.85 25.31,59.09 25.31,49.49 52.43,22.36 57.31,22.36 58.38,21.3 FEATHER1.B10
FPGA3.3  (via drill 0.25)
  Top 0.152: v12.2,67.93 18.45,67.93 25.15,61.22 25.15,60.92 25.92,60.16 26.68,60.16 27.44,59.4 27.44,58.63 32.62,53.45 32.62,51.01 B1.1
  Bottom 0.152: v12.2,67.93 4.27,75.85 PL2.4
GND  (via drill 0.25)
  Top 0.152: 67.06,12 51.82,12 51.21,11.39 43.59,11.39 U1.13 | 67.06,12 69.04,10.02 BT1.- 69.2,9.87 70.72,8.34 76.51,8.34 77.43,9.26 87.48,9.26 T2.1 | 67.06,40.65 66.15,41.56 FEATHER1.T13 | 67.06,40.65 67.22,40.5 74.07,40.5 74.68,41.11 74.68,42.02 74.07,42.63 74.07,45.98 P1.4 74.07,46.14 83.52,55.59 83.52,80.12 T3.1 | 67.06,40.65 67.06,12 | C1.2 28.05,16.88 23.17,16.88 C2.2 23.02,16.88 17.38,22.51 | 17.38,22.51 16.77,21.91 SD-2.P3 16.62,21.75 5.49,21.75 SD-2.P1 5.34,21.6 4.73,20.99 v4.73,20.69 | 17.38,22.51 17.53,22.67 17.53,26.02 SD-2.P4 17.53,26.17 17.53,33.79 SD-2.P5 17.69,33.94 17.69,38.67 | SD-2.6 4.73,31.66 4.43,31.66 3.21,32.88 3.21,35.47 3.82,36.08 5.19,36.08 SD-2.P2 5.34,36.23 7.32,38.21 7.32,38.67 | 7.32,38.67 7.32,39.58 SD-1.P1 | 17.69,38.67 18.75,39.74 SD-1.P3 18.9,39.89 19.51,40.5 v19.51,41.56 19.51,44 SD-1.P4 19.51,44.16 19.51,49.03 12.66,55.89 9,55.89 | 17.69,38.67 7.32,38.67 | 6.71,54.06 5.19,52.54 5.19,50.86 6.41,49.64 6.71,49.64 SD-1.6 | 6.71,54.06 7.17,54.06 SD-1.P2 | 9.91,59.85 12.5,59.85 13.11,59.24 13.11,57.41 18.6,51.93 19.51,51.93 SD-1.P5 | 9.91,59.85 9,58.94 9,55.89 | 9,55.89 7.32,54.21 SD-1.P2 | 6.71,54.06 2.29,58.48 2.29,58.94 PL3.2 | 6.71,54.06 SD-1.P2 | H2.29 H2.30 49.69,90.79 52.13,90.79 H2.32 | T4.1 1.68,87.59 0.77,86.68 0.77,81.95 1.53,81.19 2.14,81.19 5.04,78.29 5.04,77.84 6.1,76.77 6.1,76.01 PL2.6 6.26,75.85 9,73.11 9,60.77 9.91,59.85
  Bottom 0.152: v4.73,20.69 3.82,19.77 3.82,15.66 T1.1 | v19.51,41.56 FEATHER1.T1 | PL2.6 6.26,75.85 8.85,73.26 42.07,73.26 R1.03 42.22,73.11 61.42,53.91 61.42,47.97 66,43.39 66,41.56 FEATHER1.T13 | H2.29 49.69,88.35 48.47,88.35 47.56,89.27 12.5,89.27 10.52,87.28 2.14,87.28 1.84,87.59 T4.1
LS_C  (via drill 0.25)
  Top 0.152: v59.14,62.44 45.27,48.58 J2.01 | H2.44 67.52,90.64 67.52,88.35 H2.43
  Bottom 0.152: v59.14,62.44 59.14,80.88 61.27,83.02 61.27,83.47 62.34,84.54 62.8,84.54 63.86,85.61 63.86,86.07 64.93,87.13 66.3,87.13 67.37,88.2 H2.43
LS_NC
  Top 0.152: H2.36 H2.35
  Bottom 0.152: J2.08 62.8,48.58 62.8,58.02 58.38,62.44 58.38,87.13 57.31,88.2 H2.35
N$1
  Top 0.152: U1.14 43.59,10.02 51.21,10.02 51.82,9.41 62.03,9.41 62.49,9.87 BT1.S2+
  Bottom 0.152: BT1.S1+ 75.75,10.02 62.64,10.02 BT1.S2+
N$3
  Top 0.152: J2.02 47.71,48.42 50.15,48.42 J2.03
N$4
  Top 0.152: J2.04 52.89,48.42 55.18,48.42 J2.05
N$5
  Top 0.152: J2.06 57.92,48.42 60.36,48.42 J2.07
RBF_C
  Top 0.152: H2.42 H2.41 64.93,88.2 66,87.13 66,83.17 67.06,82.1 67.06,67.17 S1.1
RBF_NC
  Top 0.152: S1.3 67.06,56.96 67.06,60.31 63.56,63.82 63.56,81.65 63.1,82.1 61.88,82.1 60.97,83.02 60.97,83.47 59.9,84.54 59.44,84.54 58.38,85.61 58.38,86.07 57.31,87.13 55.94,87.13 54.87,88.2 H2.33
  Bottom 0.152: H2.33 54.87,88.35 54.87,90.64 H2.34
SCK  (via drill 0.25)
  Top 0.152: v3.66,31.35 4.43,30.59 4.73,30.59 SD-2.5 | v5.65,47.66 6.41,48.42 6.71,48.42 SD-1.5 | R1.04 42.07,70.83 42.07,71.89 39.63,74.33 39.63,83.02 H1.21 | v48.47,44 48.32,43.85 48.32,41.56 FEATHER1.T6
  Bottom 0.152: v3.66,31.35 3.66,34.4 5.65,36.38 v5.65,47.66 5.65,51.47 6.41,52.23 6.41,55.59 3.36,58.63 3.36,59.4 4.12,60.16 26.68,60.16 27.44,60.92 27.44,61.38 27.9,61.83 41.16,61.83 | v48.47,44 48.47,46.14 46.18,48.42 46.18,52.54 41.16,57.57 41.16,61.83 | 41.16,61.83 41.16,69.76 42.07,70.67 R1.04
SCL  (via drill 0.25)
  Top 0.152: R3.1 23.17,20.99 26.52,20.99 27.29,20.23 37.04,20.23 37.95,21.14 FEATHER1.B2 | v41,16.42 41,9.56 42.98,7.58 43.44,7.58 U1.16 | v72.85,58.48 v72.85,52.39 72.85,51.01 P1.6
  Bottom 0.152: 41,18.25 v41,16.42 | 41,18.25 38.11,21.14 FEATHER1.B2 | v72.85,58.48 74.53,60.16 74.53,76.01 67.52,83.02 H1.43 | 41,18.25 41.61,18.25 44.66,21.3 44.66,21.6 63.56,40.5 66.45,40.5 67.52,41.56 67.52,47.05 v72.85,52.39
SDA  (via drill 0.25)
  Top 0.152: R2.1 28.2,21.14 35.52,21.14 FEATHER1.B1 | v41.61,15.05 41.61,10.32 43.14,8.8 43.44,8.8 U1.15 | v73.92,60.31 73.92,51.01 P1.5 74.07,50.86 v74.84,50.1
  Bottom 0.152: 41.31,15.35 35.52,21.14 FEATHER1.B1 | 41.31,15.35 v41.61,15.05 | v73.92,60.31 73.92,74.03 64.93,83.02 H1.41 | 41.31,15.35 47.25,21.3 47.25,23.58 63.86,40.19 68.74,40.19 70.11,41.56 70.11,45.37 v74.84,50.1
UC3.3  (via drill 0.25)
  Top 0.152: v57,32.57 45.57,32.57 37.04,41.11 37.04,42.02 33.23,45.83 32.77,45.83 B2.1
  Bottom 0.152: v57,32.57 62.03,32.57 71.03,41.56 FEATHER1.T15
UC_RXO
  Bottom 0.152: PL3.8 8.24,58.94 9,58.94 25,42.94 39.17,42.94 40.55,41.56 FEATHER1.T3
UC_TXO
  Bottom 0.152: PL3.6 6.26,58.94 7.02,58.94 23.32,42.63 36.89,42.63 37.95,41.56 FEATHER1.T2
USER0  (via drill 0.25)
  Top 0.152: v74.38,79.06 74.38,61.53 61.88,49.03 61.88,48.42 58.38,44.92 41.92,44.92 41.31,45.53 41.31,47.66 31.4,57.57 31.4,61.07 30.64,61.83 29.12,61.83 15.4,75.55 15.4,76.01 14.64,76.77 10.22,76.77 9.15,77.84 8.24,77.84 PL2.7
  Bottom 0.152: v74.38,79.06 74.38,81.19 72.55,83.02 H1.47
USER1  (via drill 0.25)
  Top 0.152: v61.88,81.19 50.3,69.61 41.46,69.61 35.36,75.7 35.36,76.01 34.6,76.77 24.24,76.77 23.32,77.68 23.32,77.99 22.11,79.21 12.2,79.21 10.98,77.99 10.22,77.99 PL2.9
  Bottom 0.152: v61.88,81.19 63.56,82.87 63.56,83.78 64.32,84.54 71.48,84.54 72.55,85.61 H1.48
USER2
  Top 0.152: PL2.11 12.2,77.99 12.96,77.99 13.88,78.9 20.43,78.9 21.34,77.99 21.34,77.68 22.26,76.77 22.56,76.77 23.32,76.01 23.32,75.7 29.73,69.3 53.04,69.3 66.61,55.74 67.67,55.74 73.46,61.53 73.46,81.49 74.99,83.02 H1.49
USER3
  Bottom 0.152: PL2.13 14.33,77.84 15.09,77.84 16.16,76.77 16.62,76.77 17.38,76.01 17.38,75.55 18.6,74.33 42.53,74.33 61.88,54.98 61.88,47.97 62.49,47.36 63.25,47.36 76.21,60.31 76.21,84.54 75.14,85.61 H1.50
USER4
  Top 0.152: PL2.15 16.31,77.84 17.08,77.84 18.14,76.77 18.6,76.77 19.36,76.01 19.36,75.09 33.38,61.07 33.38,56.04 41.61,47.81 41.61,45.68 42.07,45.22 53.5,45.22 56.85,48.58 56.85,48.88 63.41,55.43 67.83,55.43 73.77,61.38 73.77,79.21 77.58,83.02 H1.51
USER5
  Bottom 0.152: PL2.17 18.3,77.84 18.75,77.84 19.82,76.77 38.72,76.77 43.14,81.19 51.82,81.19 53.65,83.02 53.65,83.47 54.72,84.54 55.18,84.54 56.24,85.61 56.24,88.66 57.31,89.72 70.57,89.72 70.72,89.88 71.03,89.88 71.48,89.42 71.48,87.74 72.4,86.83 76.51,86.83 77.58,85.76 H1.52
USER6
  Bottom 0.152: PL2.19 20.28,77.99 21.04,77.99 24.85,81.8 32.47,81.8 32.77,82.1 45.12,82.1 46.03,83.02 46.03,83.47 47.1,84.54 47.56,84.54 48.62,85.61 48.62,86.07 49.69,87.13 50.15,87.13 51.21,88.2 51.21,88.66 52.28,89.72 52.74,89.72 53.65,90.64 53.65,91.09 54.72,92.16 75.14,92.16 76.21,91.09 76.21,90.33 75.14,89.27 73.46,89.27 72.55,88.35 H2.47
USER7  (via drill 0.25)
  Top 0.152: v58.99,84.24 v46.03,84.24 | v70.87,89.27 71.18,89.27 72.55,90.64 H2.48
  Bottom 0.152: v46.03,84.24 33.99,84.24 33.38,83.63 33.38,83.17 32.32,82.1 23.17,82.1 19.36,78.29 19.36,77.68 19.97,77.07 20.58,77.07 21.34,77.84 22.11,77.84 PL2.21 | v58.99,84.24 59.9,84.24 61.27,85.61 61.27,86.07 62.34,87.13 62.8,87.13 63.86,88.2 63.86,88.66 64.47,89.27 v70.87,89.27
USER8
  Top 0.152: PL2.23 24.24,77.99 25,77.99 29.12,82.1 34.91,82.1 35.97,83.17 35.97,83.63 36.89,84.54 44.97,84.54 46.03,85.61 46.03,86.07 47.1,87.13 50.15,87.13 51.21,88.2 51.21,88.66 52.28,89.72 52.74,89.72 53.65,90.64 53.65,91.09 54.72,92.16 75.14,92.16 76.21,91.09 76.21,89.42 75.14,88.35 H2.49
USER9
  Bottom 0.152: PL2.25 26.37,77.84 27.13,77.84 27.9,77.07 38.56,77.07 42.98,81.49 49.54,81.49 51.21,83.17 51.21,83.63 52.13,84.54 52.59,84.54 53.65,85.61 53.65,86.07 54.72,87.13 55.18,87.13 55.94,87.89 55.94,90.94 56.85,91.86 73.92,91.86 74.99,90.79 H2.50
USER10  (via drill 0.25)
  Top 0.152: v50.91,85.46 50.91,85.91 52.13,87.13 52.59,87.13 53.65,88.2 53.65,88.66 54.72,89.72 55.18,89.72 56.24,90.79 56.24,91.25 56.85,91.86 73.01,91.86 74.07,90.79 74.07,87.74 74.68,87.13 76.51,87.13 77.58,88.2 H2.51
  Bottom 0.152: v50.91,85.46 49.99,84.54 49.54,84.54 48.62,83.63 48.62,83.17 47.25,81.8 32.93,81.8 29.12,77.99 28.35,77.99 PL2.27
USER11  (via drill 0.25)
  Top 0.152: v62.95,81.49 62.64,81.8 46.95,81.8 46.03,82.71 46.03,83.17 44.97,84.24 39.17,84.24 38.41,83.47 38.41,83.02 37.19,81.8 34.91,81.8 31.1,77.99 30.33,77.99 PL2.29 | v75.29,84.39 76.51,85.61 76.51,86.07 77.58,87.13 78.04,87.13 78.65,87.74 78.65,89.72 77.73,90.64 H2.52
  Bottom 0.152: v62.95,81.49 62.95,81.8 63.86,82.71 63.86,83.63 64.47,84.24 75.14,84.24 v75.29,84.39

### Text on the board
tPlace: Todo: | RBF Switch | barrel power jack | 3D Parts | Copper Keepout areas